# EAGLE schematic espyolsuz (EAGLE 9.6.2)
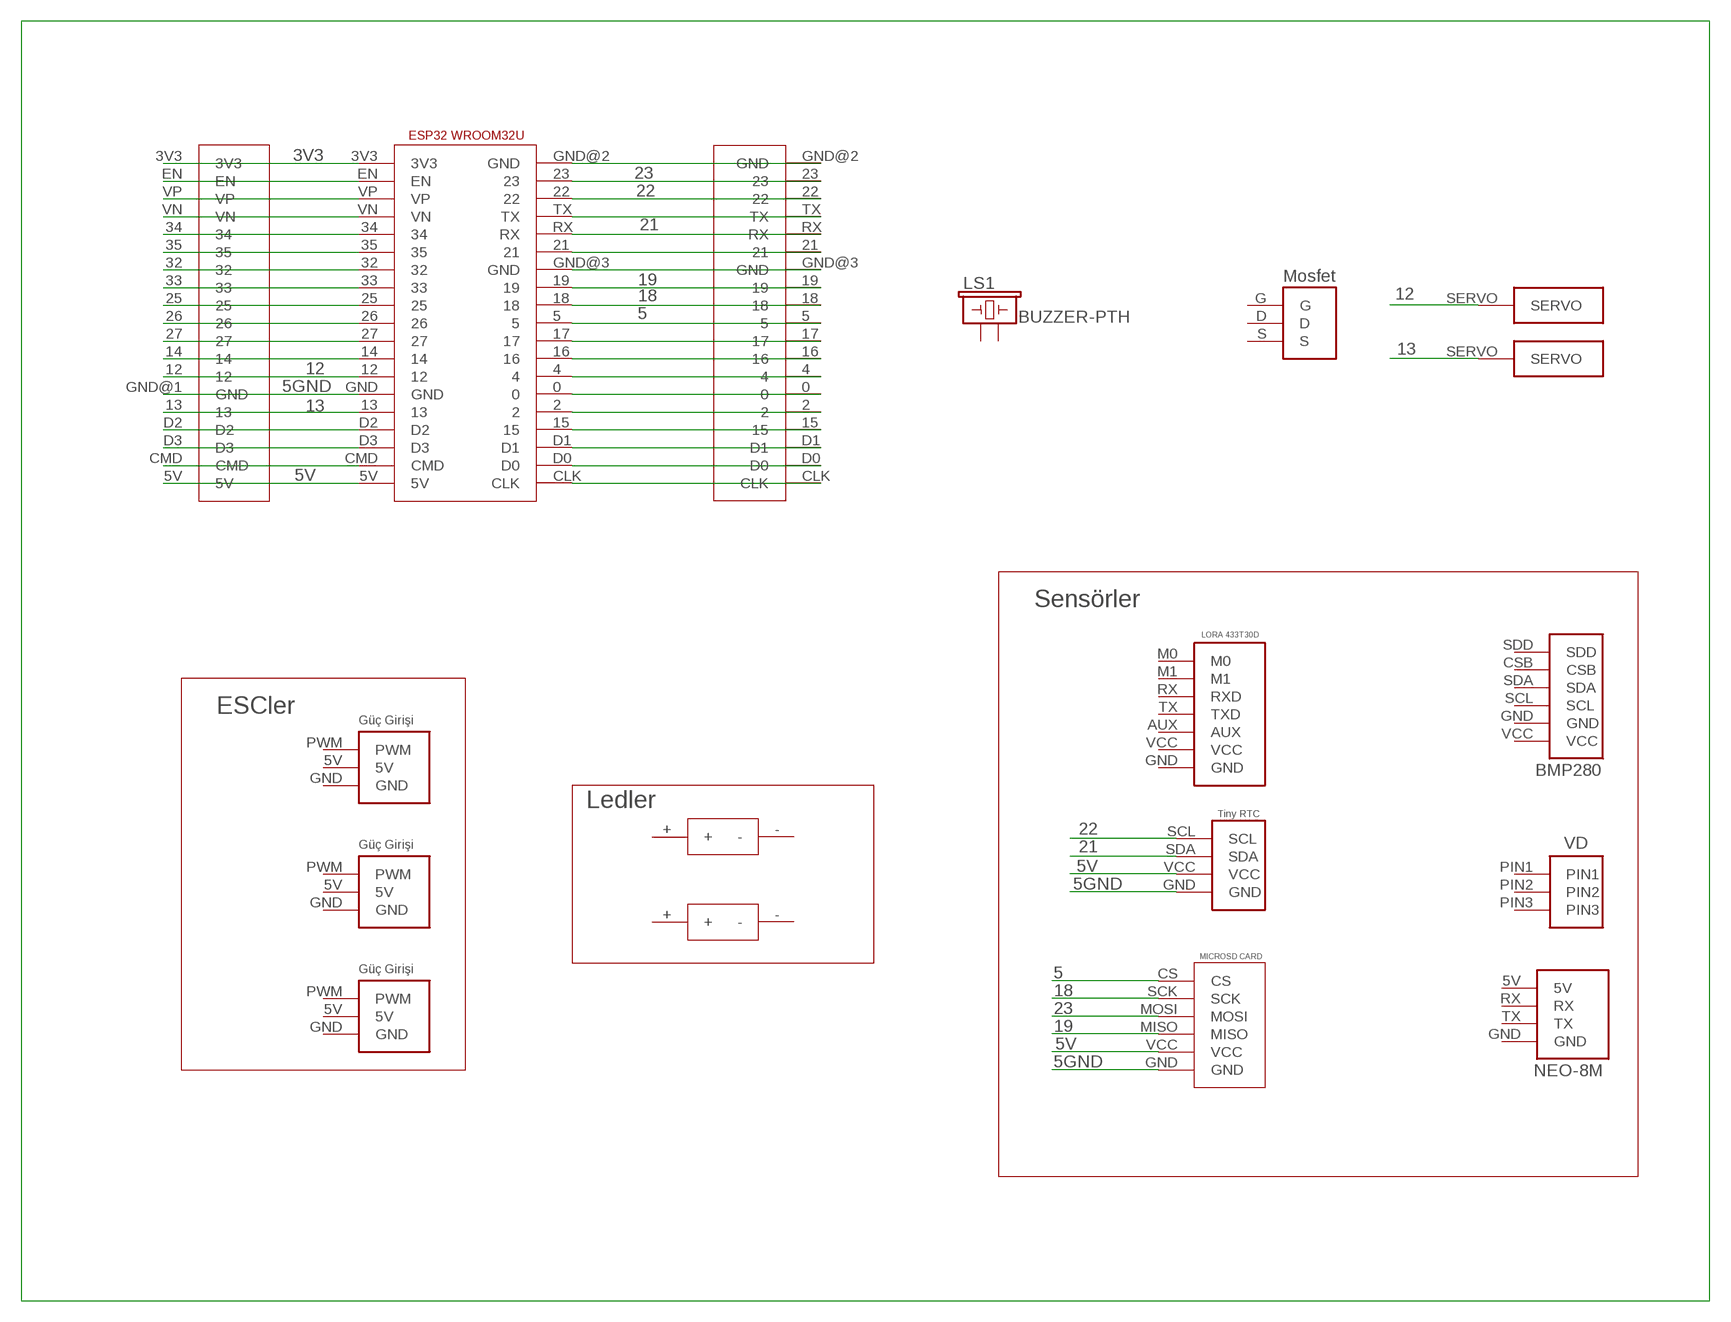
[diagram p0: schematic, sheet 1]

## Parts
BMP1  BMP280  [BMP280]
LS1  BUZZER-PTH  [BUZZER-12MM]
U$1  TINYRTC  [TINYRTC]
U$2  VOLTAGE_DIVIDER  [VOLTAGE_DIVIDER]
U$3  NEOM8N  [NEO8M]
U$4  ESP32WROOM32U  [ESP32WROOM32U]
U$5  LORAFULLSIZE  [LORAFULLSIZE]
U$6  MICROSD_CARD  [MICROSD_CARD]
U$7  SERVO_SIGNAL  [SERVO_SIGNAL]
U$9  SERVO_SIGNAL  [SERVO_SIGNAL]
U$11  ESC_GIRIS  [ESC_GIRIS]
U$12  ESC_GIRIS  [ESC_GIRIS]
U$13  ESC_GIRIS  [ESC_GIRIS]
U$14  ESPSAGPIN  [ESPSAGPIN]
U$15  ESPSOLPIN  [ESPSOLPIN]
U$16  MOSFET  [MOSFET]
U$17  LED  [LED]
U$18  LED  [LED]

## Nets
3V3: U$4.3V3 U$15.3V3
5: U$4.5 U$6.CS U$14.5
5GND: U$1.GND U$4.GND U$6.GND U$15.GND@1(GND)
5V: U$1.VCC U$4.5V U$6.VCC U$15.5V
12: U$4.12 U$7.SERVO U$15.12
13: U$4.13 U$9.SERVO U$15.13
18: U$4.18 U$6.SCK U$14.18
19: U$4.19 U$6.MISO U$14.19
21: U$1.SDA U$4.21 U$14.21
22: U$1.SCL U$4.22 U$14.22
23: U$4.23 U$6.MOSI U$14.23
N$3: U$4.EN U$15.EN
N$4: U$4.VP U$15.VP
N$5: U$4.VN U$15.VN
N$6: U$4.34 U$15.34
N$7: U$4.35 U$15.35
N$8: U$4.32 U$15.32
N$9: U$4.33 U$15.33
N$10: U$4.25 U$15.25
N$11: U$4.26 U$15.26
N$12: U$4.27 U$15.27
N$13: U$4.14 U$15.14
N$17: U$4.D2 U$15.D2
N$18: U$4.D3 U$15.D3
N$19: U$4.CMD U$15.CMD
N$21: U$4.GND@2(GND) U$14.GND@2(GND)
N$24: U$4.TX U$14.TX
N$25: U$4.RX U$14.RX
N$27: U$4.GND@3(GND) U$14.GND@3(GND)
N$31: U$4.17 U$14.17
N$32: U$4.16 U$14.16
N$33: U$4.4 U$14.4
N$34: U$4.0 U$14.0
N$35: U$4.2 U$14.2
N$36: U$4.15 U$14.15
N$37: U$4.D1 U$14.D1
N$38: U$4.D0 U$14.D0
N$39: U$4.CLK U$14.CLK
Unconnected: BMP1.CSB BMP1.GND BMP1.SCL BMP1.SDA BMP1.SDD BMP1.VCC LS1.+ LS1.- U$2.PIN1 U$2.PIN2 U$2.PIN3 U$3.5V U$3.GND U$3.RX U$3.TX U$5.AUX U$5.GND U$5.M0 U$5.M1 U$5.RX(RXD) U$5.TX(TXD) U$5.VCC U$11.5V U$11.GND U$11.PWM U$12.5V U$12.GND U$12.PWM U$13.5V U$13.GND U$13.PWM U$16.D U$16.G U$16.S U$17.+ U$17.- U$18.+ U$18.-

## Notes on the sheet
- Sensörler
- ESCler
- Ledler

## Library data of the parts
BMP1 = SpatiumB:BMP280
LS1 = SparkFun-Electromechanical:BUZZER: Buzzer Small round buzzers that operate around the audible 2kHz range. You can use these as speakers to create simple music or user interfaces. Variant Overview: PTH - Mini Speaker - PC Mount 12mm 2.048kHz <https://www.sparkfun.com/products/7950> PTH_KIT - Mini Speaker - PC Mount 12mm 2.048kHz <https://www.sparkfun.com/products/7950> KIT simplifies soldering by adding stop mask to one side of the pads. PTH_NO_SILK - Mini Speaker - PC Mount 12mm 2.048kHz <https://www.sparkfun.com/products/7950> No silkscreen indicator of buzzer outline. PTH_KIT_NO_SILK - Mini Speaker - PC Mount 12mm 2.048kHz <https://www.sparkfun.com/products/7950> KIT package w/o silkscreen SMD - Buzzer Audio Magnetic (CCV-084B16) SMD buzzer used on, e.g. the LilyPad Buzzer <https://www.sparkfun.com/products/8463> and RFID USB Reader <https://www.sparkfun.com/products/9963>. SMD_KIT - Buzzer Audio Magnetic (CCV-084B16) SMD Buzzer with elongated pins to make soldering easier. Used on the SparkFun Simon Says - Surface Mount Soldering Kit <https://www.sparkfun.com/products/10935>.; PROD_ID: COMP-08253; SF_SKU: COM-07950
U$1 = SpatMuy2022:TINYRTC
U$2 = SpatiumB:VOLTAGE_DIVIDER
U$3 = SpatiumB:NEOM8N
U$4 = SpatMuy2022:ESP32WROOM32U
U$5 = SpatMuy2022:LORAFULLSIZE
U$6 = SpatMuy2022:MICROSD_CARD
U$7 U$9 = SpatiumB:SERVO_SIGNAL
U$11-U$13 = SpatiumB:ESC_GIRIS
U$14 = SpatMuy2022:ESPSAGPIN
U$15 = SpatMuy2022:ESPSOLPIN
U$16 = SpatiumB:MOSFET
U$17 U$18 = SpatMuy2022:LED